# Altium schematic sheet fpga01-serdes-power.SchDoc
size Tabloid; SheetNumber: 43; SheetTotal: 71
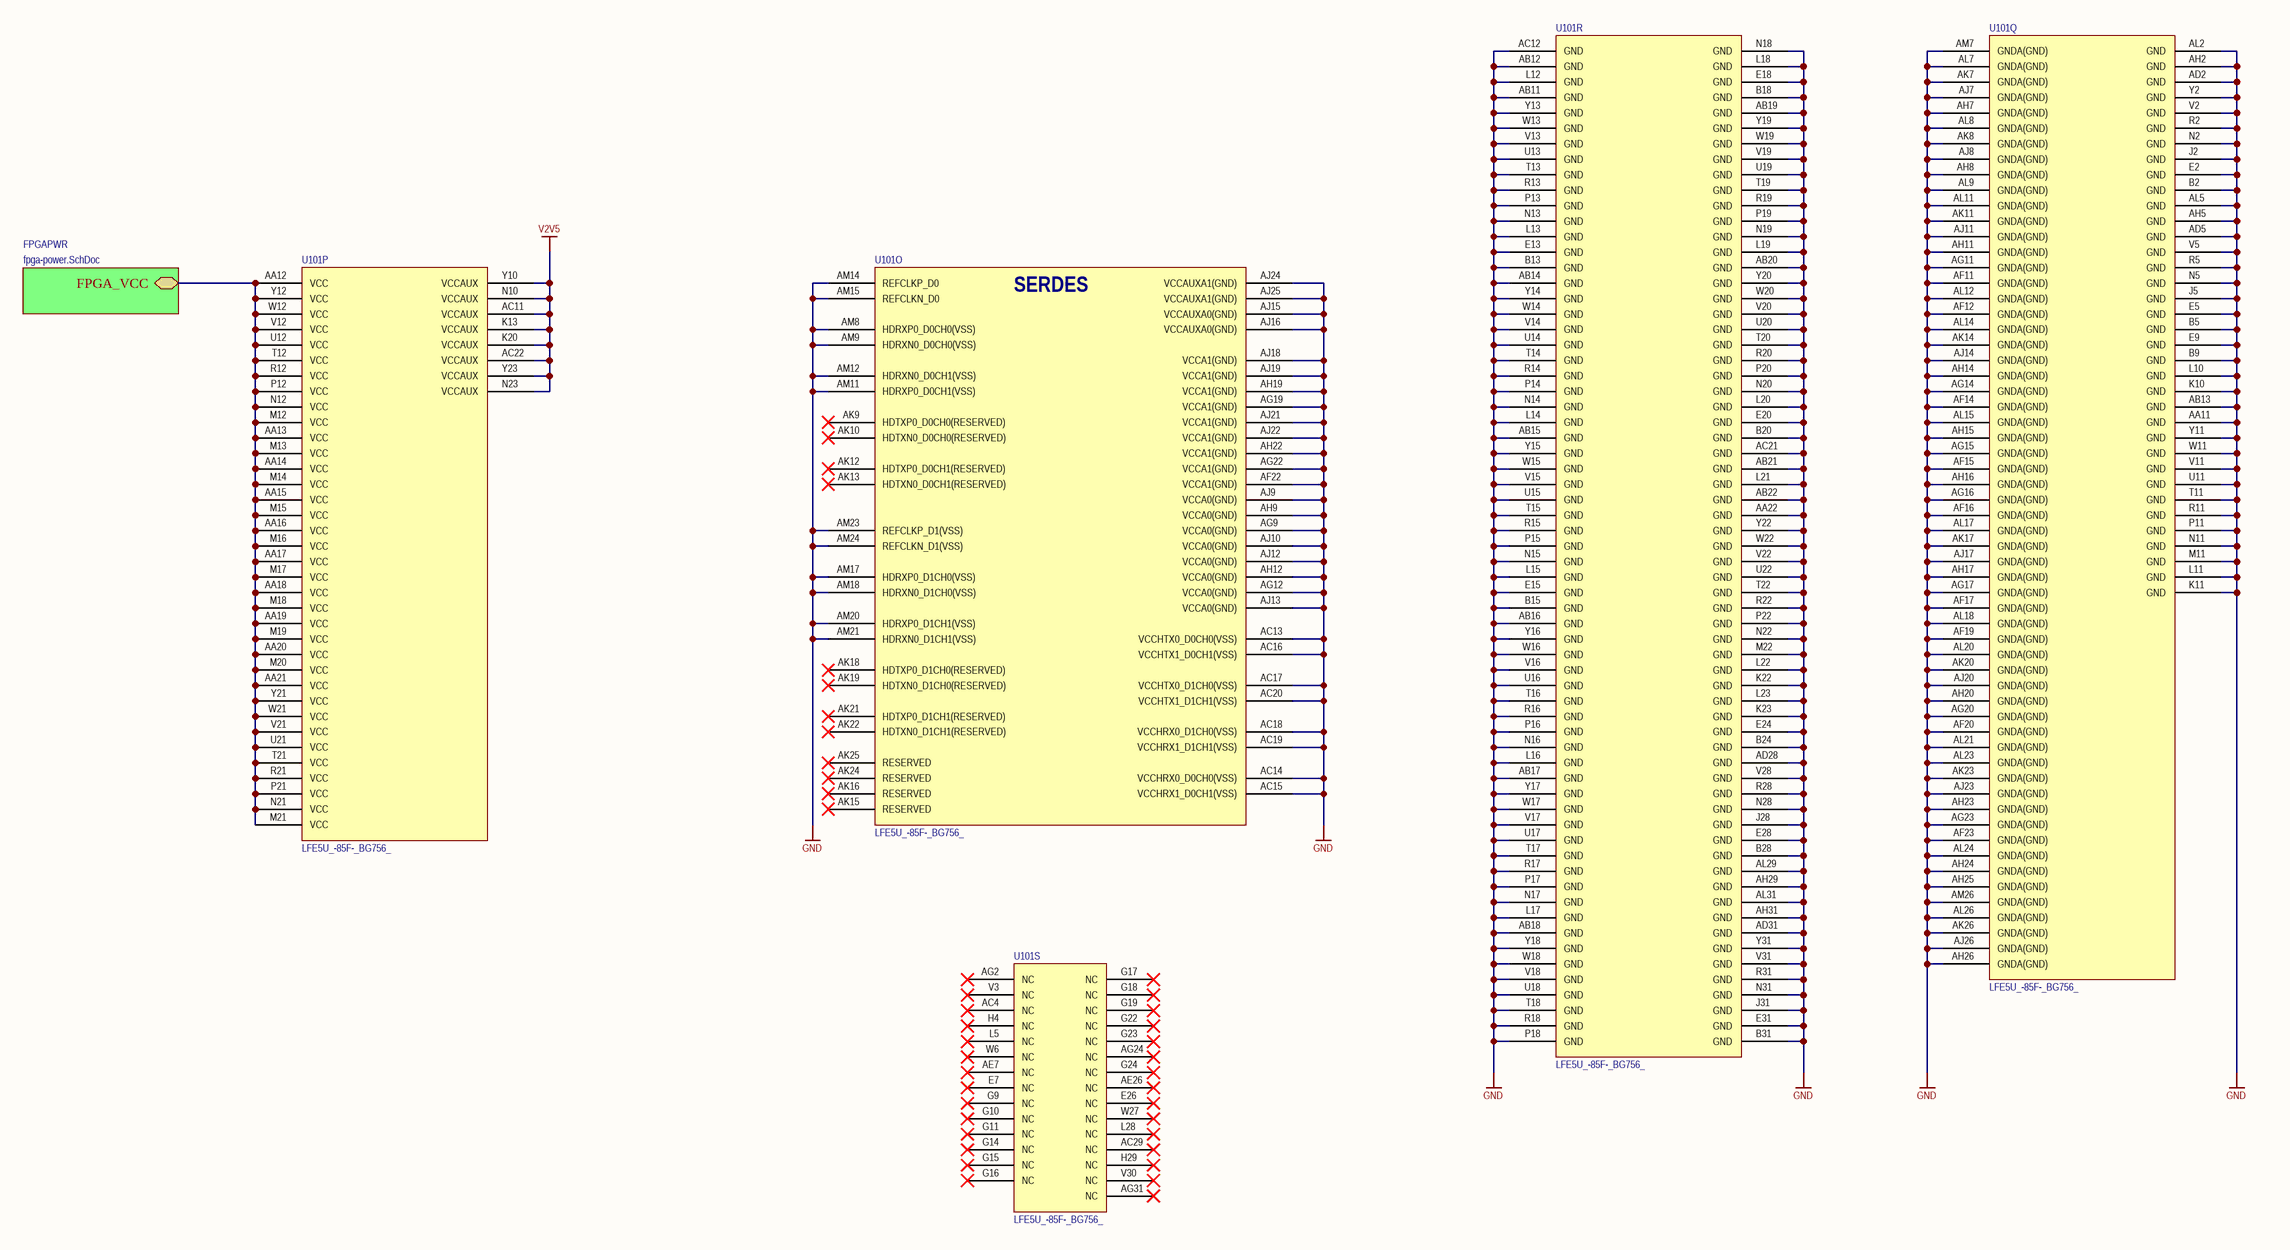
[diagram p0: fpga01-serdes-power.SchDoc]

## Parts
U101  LFE5U_-85F-_BG756_  [caBGA756]  (parts O,P,Q,R,S of 19)

## Sub-sheets
FPGAPWR = fpga-power.SchDoc: FPGA_VCC

## Nets
GND: U101.AA11(GND) U101.AA22(GND) U101.AB11(GND) U101.AB12(GND) U101.AB13(GND) U101.AB14(GND) U101.AB15(GND) U101.AB16(GND) U101.AB17(GND) U101.AB18(GND) U101.AB19(GND) U101.AB20(GND) U101.AB21(GND) U101.AB22(GND) U101.AC12(GND) U101.AC13(VCCHTX0_D0CH0(VSS)) U101.AC14(VCCHRX0_D0CH0(VSS)) U101.AC15(VCCHRX1_D0CH1(VSS)) U101.AC16(VCCHTX1_D0CH1(VSS)) U101.AC17(VCCHTX0_D1CH0(VSS)) U101.AC18(VCCHRX0_D1CH0(VSS)) U101.AC19(VCCHRX1_D1CH1(VSS)) U101.AC20(VCCHTX1_D1CH1(VSS)) U101.AC21(GND) U101.AD2(GND) U101.AD5(GND) U101.AD28(GND) U101.AD31(GND) U101.AF11(GNDA(GND)) U101.AF12(GNDA(GND)) U101.AF14(GNDA(GND)) U101.AF15(GNDA(GND)) U101.AF16(GNDA(GND)) U101.AF17(GNDA(GND)) U101.AF19(GNDA(GND)) U101.AF20(GNDA(GND)) U101.AF22(VCCA1(GND)) U101.AF23(GNDA(GND)) U101.AG9(VCCA0(GND)) U101.AG11(GNDA(GND)) U101.AG12(VCCA0(GND)) U101.AG14(GNDA(GND)) U101.AG15(GNDA(GND)) U101.AG16(GNDA(GND)) U101.AG17(GNDA(GND)) U101.AG19(VCCA1(GND)) U101.AG20(GNDA(GND)) U101.AG22(VCCA1(GND)) U101.AG23(GNDA(GND)) U101.AH2(GND) U101.AH5(GND) U101.AH7(GNDA(GND)) U101.AH8(GNDA(GND)) U101.AH9(VCCA0(GND)) U101.AH11(GNDA(GND)) U101.AH12(VCCA0(GND)) U101.AH14(GNDA(GND)) U101.AH15(GNDA(GND)) U101.AH16(GNDA(GND)) U101.AH17(GNDA(GND)) U101.AH19(VCCA1(GND)) U101.AH20(GNDA(GND)) U101.AH22(VCCA1(GND)) U101.AH23(GNDA(GND)) U101.AH24(GNDA(GND)) U101.AH25(GNDA(GND)) U101.AH26(GNDA(GND)) U101.AH29(GND) U101.AH31(GND) U101.AJ7(GNDA(GND)) U101.AJ8(GNDA(GND)) U101.AJ9(VCCA0(GND)) U101.AJ10(VCCA0(GND)) U101.AJ11(GNDA(GND)) U101.AJ12(VCCA0(GND)) U101.AJ13(VCCA0(GND)) U101.AJ14(GNDA(GND)) U101.AJ15(VCCAUXA0(GND)) U101.AJ16(VCCAUXA0(GND)) U101.AJ17(GNDA(GND)) U101.AJ18(VCCA1(GND)) U101.AJ19(VCCA1(GND)) U101.AJ20(GNDA(GND)) U101.AJ21(VCCA1(GND)) U101.AJ22(VCCA1(GND)) U101.AJ23(GNDA(GND)) U101.AJ24(VCCAUXA1(GND)) U101.AJ25(VCCAUXA1(GND)) U101.AJ26(GNDA(GND)) U101.AK7(GNDA(GND)) U101.AK8(GNDA(GND)) U101.AK11(GNDA(GND)) U101.AK14(GNDA(GND)) U101.AK17(GNDA(GND)) U101.AK20(GNDA(GND)) U101.AK23(GNDA(GND)) U101.AK26(GNDA(GND)) U101.AL2(GND) U101.AL5(GND) U101.AL7(GNDA(GND)) U101.AL8(GNDA(GND)) U101.AL9(GNDA(GND)) U101.AL11(GNDA(GND)) U101.AL12(GNDA(GND)) U101.AL14(GNDA(GND)) U101.AL15(GNDA(GND)) U101.AL17(GNDA(GND)) U101.AL18(GNDA(GND)) U101.AL20(GNDA(GND)) U101.AL21(GNDA(GND)) U101.AL23(GNDA(GND)) U101.AL24(GNDA(GND)) U101.AL26(GNDA(GND)) U101.AL29(GND) U101.AL31(GND) U101.AM7(GNDA(GND)) U101.AM8(HDRXP0_D0CH0(VSS)) U101.AM9(HDRXN0_D0CH0(VSS)) U101.AM11(HDRXP0_D0CH1(VSS)) U101.AM12(HDRXN0_D0CH1(VSS)) U101.AM14(REFCLKP_D0) U101.AM15(REFCLKN_D0) U101.AM17(HDRXP0_D1CH0(VSS)) U101.AM18(HDRXN0_D1CH0(VSS)) U101.AM20(HDRXP0_D1CH1(VSS)) U101.AM21(HDRXN0_D1CH1(VSS)) U101.AM23(REFCLKP_D1(VSS)) U101.AM24(REFCLKN_D1(VSS)) U101.AM26(GNDA(GND)) U101.B2(GND) U101.B5(GND) U101.B9(GND) U101.B13(GND) U101.B15(GND) U101.B18(GND) U101.B20(GND) U101.B24(GND) U101.B28(GND) U101.B31(GND) U101.E2(GND) U101.E5(GND) U101.E9(GND) U101.E13(GND) U101.E15(GND) U101.E18(GND) U101.E20(GND) U101.E24(GND) U101.E28(GND) U101.E31(GND) U101.J2(GND) U101.J5(GND) U101.J28(GND) U101.J31(GND) U101.K10(GND) U101.K11(GND) U101.K22(GND) U101.K23(GND) U101.L10(GND) U101.L11(GND) U101.L12(GND) U101.L13(GND) U101.L14(GND) U101.L15(GND) U101.L16(GND) U101.L17(GND) U101.L18(GND) U101.L19(GND) U101.L20(GND) U101.L21(GND) U101.L22(GND) U101.L23(GND) U101.M11(GND) U101.M22(GND) U101.N2(GND) U101.N5(GND) U101.N11(GND) U101.N13(GND) U101.N14(GND) U101.N15(GND) U101.N16(GND) U101.N17(GND) U101.N18(GND) U101.N19(GND) U101.N20(GND) U101.N22(GND) U101.N28(GND) U101.N31(GND) U101.P11(GND) U101.P13(GND) U101.P14(GND) U101.P15(GND) U101.P16(GND) U101.P17(GND) U101.P18(GND) U101.P19(GND) U101.P20(GND) U101.P22(GND) U101.R2(GND) U101.R5(GND) U101.R11(GND) U101.R13(GND) U101.R14(GND) U101.R15(GND) U101.R16(GND) U101.R17(GND) U101.R18(GND) U101.R19(GND) U101.R20(GND) U101.R22(GND) U101.R28(GND) U101.R31(GND) U101.T11(GND) U101.T13(GND) U101.T14(GND) U101.T15(GND) U101.T16(GND) U101.T17(GND) U101.T18(GND) U101.T19(GND) U101.T20(GND) U101.T22(GND) U101.U11(GND) U101.U13(GND) U101.U14(GND) U101.U15(GND) U101.U16(GND) U101.U17(GND) U101.U18(GND) U101.U19(GND) U101.U20(GND) U101.U22(GND) U101.V2(GND) U101.V5(GND) U101.V11(GND) U101.V13(GND) U101.V14(GND) U101.V15(GND) U101.V16(GND) U101.V17(GND) U101.V18(GND) U101.V19(GND) U101.V20(GND) U101.V22(GND) U101.V28(GND) U101.V31(GND) U101.W11(GND) U101.W13(GND) U101.W14(GND) U101.W15(GND) U101.W16(GND) U101.W17(GND) U101.W18(GND) U101.W19(GND) U101.W20(GND) U101.W22(GND) U101.Y2(GND) U101.Y11(GND) U101.Y13(GND) U101.Y14(GND) U101.Y15(GND) U101.Y16(GND) U101.Y17(GND) U101.Y18(GND) U101.Y19(GND) U101.Y20(GND) U101.Y22(GND) U101.Y31(GND)
V2V5: U101.AC11(VCCAUX) U101.AC22(VCCAUX) U101.K13(VCCAUX) U101.K20(VCCAUX) U101.N10(VCCAUX) U101.N23(VCCAUX) U101.Y10(VCCAUX) U101.Y23(VCCAUX)
NetU101_AA12: U101.AA12(VCC) U101.AA13(VCC) U101.AA14(VCC) U101.AA15(VCC) U101.AA16(VCC) U101.AA17(VCC) U101.AA18(VCC) U101.AA19(VCC) U101.AA20(VCC) U101.AA21(VCC) U101.M12(VCC) U101.M13(VCC) U101.M14(VCC) U101.M15(VCC) U101.M16(VCC) U101.M17(VCC) U101.M18(VCC) U101.M19(VCC) U101.M20(VCC) U101.M21(VCC) U101.N12(VCC) U101.N21(VCC) U101.P12(VCC) U101.P21(VCC) U101.R12(VCC) U101.R21(VCC) U101.T12(VCC) U101.T21(VCC) U101.U12(VCC) U101.U21(VCC) U101.V12(VCC) U101.V21(VCC) U101.W12(VCC) U101.W21(VCC) U101.Y12(VCC) U101.Y21(VCC) ; sheet FPGAPWR/FPGA_VCC

Not connected (* = marked no-connect by the designer): U101 AC4(NC)* AC29(NC)* AE7(NC)* AE26(NC)* AG2(NC)* AG24(NC)* AG31(NC)* AK9(HDTXP0_D0CH0(RESERVED))* AK10(HDTXN0_D0CH0(RESERVED))* AK12(HDTXP0_D0CH1(RESERVED))* AK13(HDTXN0_D0CH1(RESERVED))* AK15(RESERVED)* AK16(RESERVED)* AK18(HDTXP0_D1CH0(RESERVED))* AK19(HDTXN0_D1CH0(RESERVED))* AK21(HDTXP0_D1CH1(RESERVED))* AK22(HDTXN0_D1CH1(RESERVED))* AK24(RESERVED)* AK25(RESERVED)* E7(NC)* E26(NC)* G9(NC)* G10(NC)* G11(NC)* G14(NC)* G15(NC)* G16(NC)* G17(NC)* G18(NC)* G19(NC)* G22(NC)* G23(NC)* G24(NC)* H4(NC)* H29(NC)* L5(NC)* L28(NC)* V3(NC)* V30(NC)* W6(NC)* W27(NC)*

## Notes on the sheet
- (in symbol LFE5U_-85F-_BG756_, part O) SERDES

## Library data of the parts
U101 = LFE5U_-85F-_BG756_: ECP5 FPGA, 85k LUT, 756-caBGA; Manufacturer: Lattice Semiconductor; Manufacturer P/N: LFE5U_-85F-_BG756_